# EAGLE design SiNEDevBoard (EAGLE 6.1)
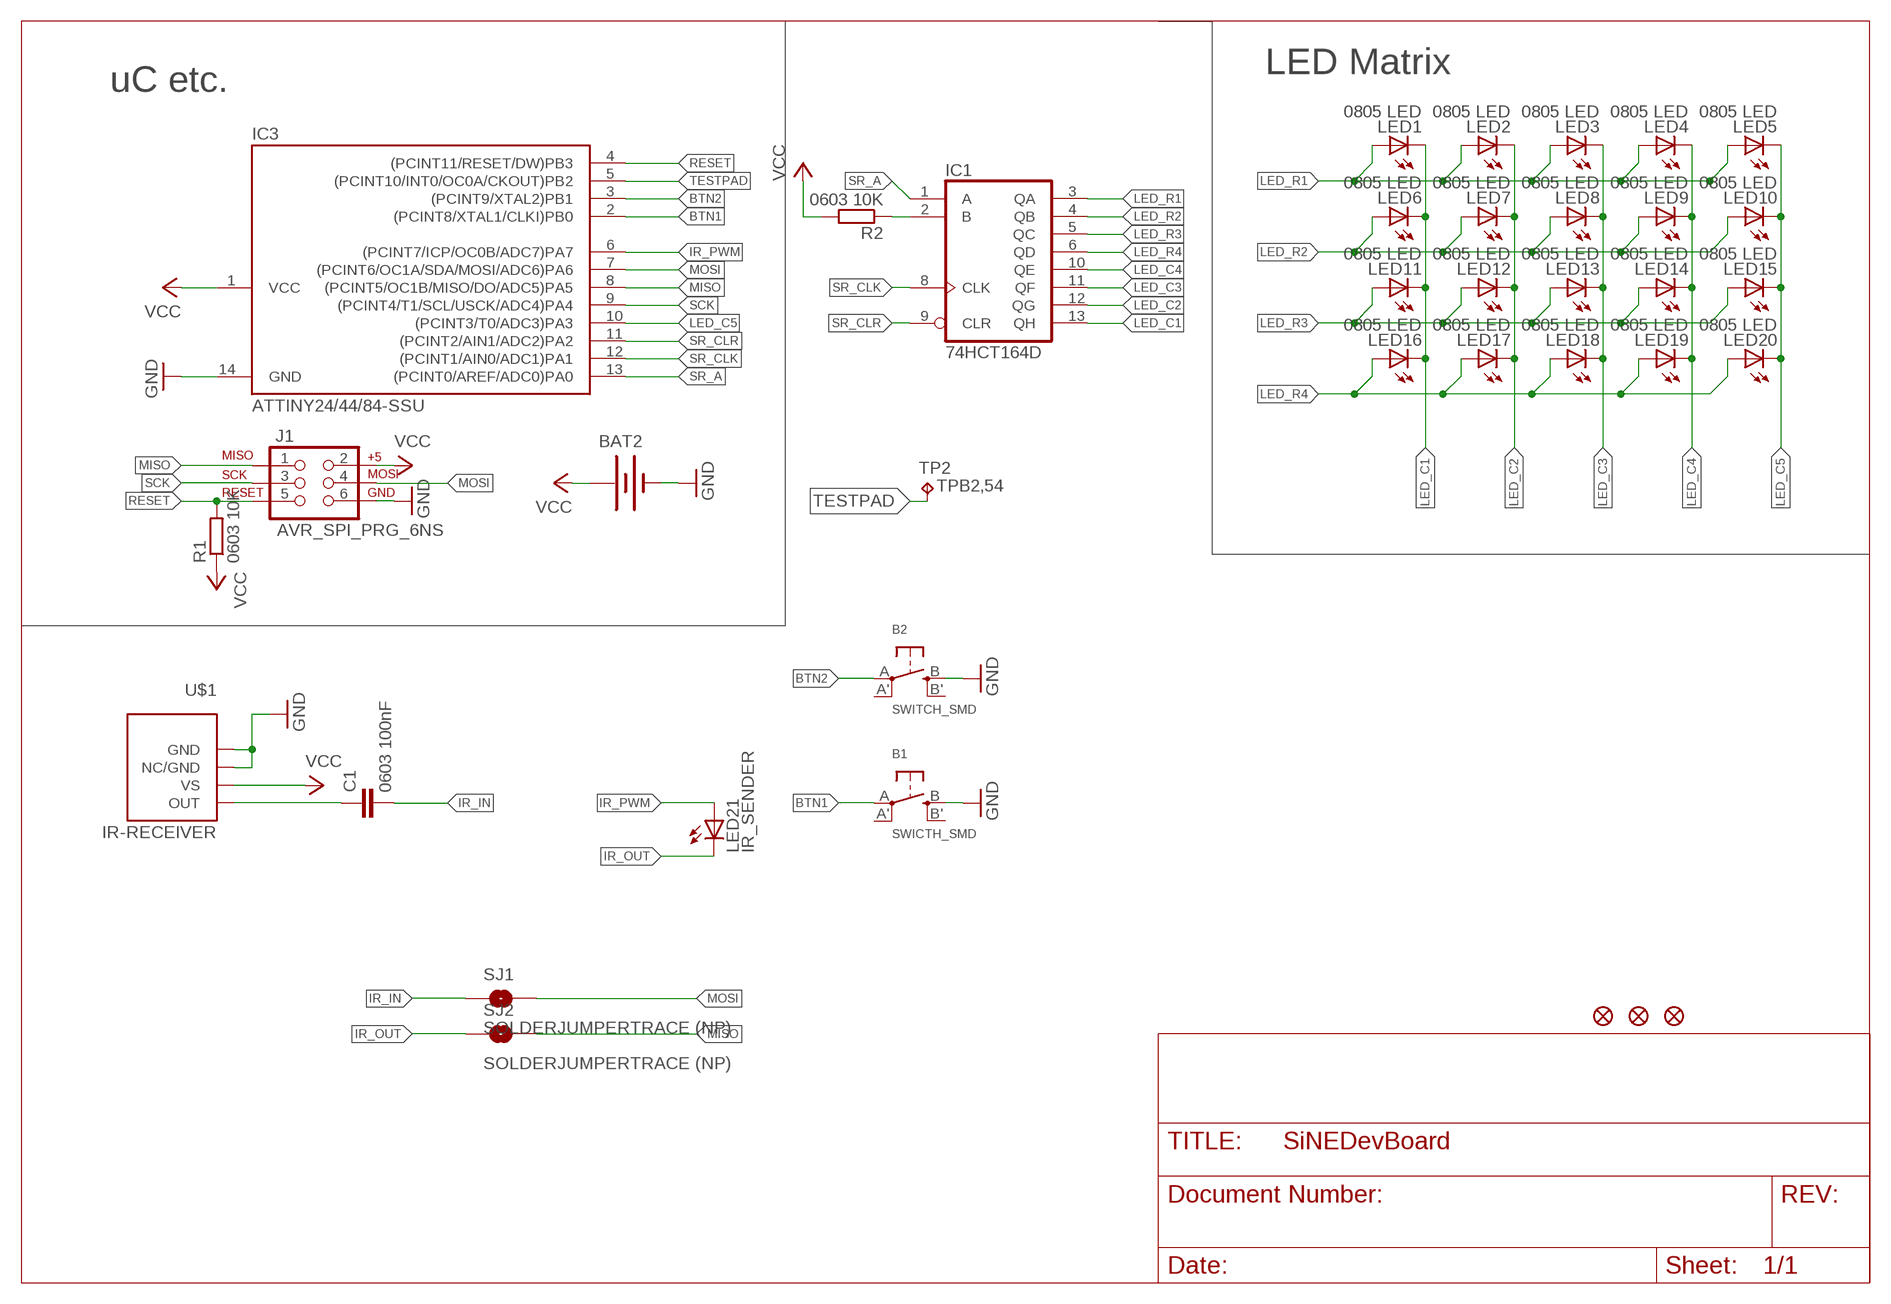
[diagram p0: schematic, sheet 1]

## Parts
B1  SWICTH_SMD  SWITCH_TACT_SMT  [EVQ-Q2]
B2  SWITCH_SMD  SWITCH_TACT_SMT  [EVQ-Q2]
BAT2  BATTERY20SMD  [BATTCON_20MM]
C1  0603 100nF  C-EUC0805  [C0805]
IC1  74HCT164D  [SO14]
IC3  ATTINY24/44/84-SSU  [SOIC14]
J1  AVR_SPI_PRG_6NS  [2X3-NS]
JP1  FIDUCIAL1X2.5-STOP  [FIDUCIAL-1X2.5-STOP]
JP2  FIDUCIAL1X2.5-STOP  [FIDUCIAL-1X2.5-STOP]
JP3  FIDUCIAL1X2.5-STOP  [FIDUCIAL-1X2.5-STOP]
LED1  0805 LED  LEDCHIPLED_0805  [CHIPLED_0805]
LED2  0805 LED  LEDCHIPLED_0805  [CHIPLED_0805]
LED3  0805 LED  LEDCHIPLED_0805  [CHIPLED_0805]
LED4  0805 LED  LEDCHIPLED_0805  [CHIPLED_0805]
LED5  0805 LED  LEDCHIPLED_0805  [CHIPLED_0805]
LED6  0805 LED  LEDCHIPLED_0805  [CHIPLED_0805]
LED7  0805 LED  LEDCHIPLED_0805  [CHIPLED_0805]
LED8  0805 LED  LEDCHIPLED_0805  [CHIPLED_0805]
LED9  0805 LED  LEDCHIPLED_0805  [CHIPLED_0805]
LED10  0805 LED  LEDCHIPLED_0805  [CHIPLED_0805]
LED11  0805 LED  LEDCHIPLED_0805  [CHIPLED_0805]
LED12  0805 LED  LEDCHIPLED_0805  [CHIPLED_0805]
LED13  0805 LED  LEDCHIPLED_0805  [CHIPLED_0805]
LED14  0805 LED  LEDCHIPLED_0805  [CHIPLED_0805]
LED15  0805 LED  LEDCHIPLED_0805  [CHIPLED_0805]
LED16  0805 LED  LEDCHIPLED_0805  [CHIPLED_0805]
LED17  0805 LED  LEDCHIPLED_0805  [CHIPLED_0805]
LED18  0805 LED  LEDCHIPLED_0805  [CHIPLED_0805]
LED19  0805 LED  LEDCHIPLED_0805  [CHIPLED_0805]
LED20  0805 LED  LEDCHIPLED_0805  [CHIPLED_0805]
LED21  IR_SENDER  LEDCHIPLED_1206  [CHIPLED_1206]
R1  0603 10K  R-EU_R0805  [R0805]
R2  0603 10K  R-EU_R0805  [R0805]
SJ1  SOLDERJUMPERTRACE (NP)  SOLDERJUMPERTRACE  [SJ_2S-TRACE]
SJ2  SOLDERJUMPERTRACE (NP)  SOLDERJUMPERTRACE  [SJ_2S-TRACE]
TP2  TPB2,54  [B2,54]
U$1  IR-RECEIVER  [TSOP35X]

## Nets
BTN1: B1.A(P) IC3.2((PCINT8/XTAL1/CLKI)PB0)
BTN2: B2.A(P) IC3.3((PCINT9/XTAL2)PB1)
GND: B1.B(S) B2.B(S) BAT2.2(-) IC3.14(GND) J1.6 U$1.1(GND) U$1.2(NC/GND)
IR_IN: C1.2 SJ1.1
IR_OUT: LED21.C SJ2.1
IR_PWM: IC3.6((PCINT7/ICP/OC0B/ADC7)PA7) LED21.A
LED_C1: IC1.13(QH) LED1.C LED6.C LED11.C LED16.C
LED_C2: IC1.12(QG) LED2.C LED7.C LED12.C LED17.C
LED_C3: IC1.11(QF) LED3.C LED8.C LED13.C LED18.C
LED_C4: IC1.10(QE) LED4.C LED9.C LED14.C LED19.C
LED_C5: IC3.10((PCINT3/T0/ADC3)PA3) LED5.C LED10.C LED15.C LED20.C
LED_R1: IC1.3(QA) LED1.A LED2.A LED3.A LED4.A LED5.A
LED_R2: IC1.4(QB) LED6.A LED7.A LED8.A LED9.A LED10.A
LED_R3: IC1.5(QC) LED11.A LED12.A LED13.A LED14.A LED15.A
LED_R4: IC1.6(QD) LED16.A LED17.A LED18.A LED19.A LED20.A
MISO: IC3.8((PCINT5/OC1B/MISO/DO/ADC5)PA5) J1.1 SJ2.2
MOSI: IC3.7((PCINT6/OC1A/SDA/MOSI/ADC6)PA6) J1.4 SJ1.2
N$1: IC1.2(B) R2.1
N$6: C1.1 U$1.4(OUT)
RESET: IC3.4((PCINT11/RESET/DW)PB3) J1.5 R1.2
SCK: IC3.9((PCINT4/T1/SCL/USCK/ADC4)PA4) J1.3
SR_A: IC1.1(A) IC3.13((PCINT0/AREF/ADC0)PA0)
SR_CLK: IC1.8(CLK) IC3.12((PCINT1/AIN0/ADC1)PA1)
SR_CLR: IC1.9(CLR) IC3.11((PCINT2/AIN1/ADC2)PA2)
TESTPAD: IC3.5((PCINT10/INT0/OC0A/CKOUT)PB2) TP2.TP
VCC: BAT2.1(+) IC3.1(VCC) J1.2 R1.1 R2.2 U$1.3(VS)
Unconnected: B1.A'(P1) B1.B'(S1) B2.A'(P1) B2.B'(S1)

## Notes on the sheet
- LED Matrix
- uC etc.

## Power pins joined to a net without a drawn wire
GND: IC1.7(GND)
VCC: IC1.14(VCC)

## Library data of the parts
B1 B2 = microbuilder:SWITCH_TACT_SMT: SMT Tact Switches 6x6mm - Digikey: P12940SCT-ND KMR2 (4.6x2.8mm) - Digikey: 401-1426-1-ND EVQ-PQHB55 - Light Touch, 160GF (4.5x4.5mm) - Digikey: P8090SCT-ND
BAT2 = SiNE Parts:BATTERY: Battery Holders Various common sizes : AA, AAA, 20mm coin cell and 12mm coin cell.
C1 = rcl:C-EU: CAPACITOR, European symbol
IC1 = SiNE Parts:74*164: 8-bit parallel out SHIFT REGISTER
IC3 = SiNE Parts:ATTINY24/44/84
J1 = AVR Header:AVR_SPI_PRG_6: AVR ISP 6 Pin This is the reduced ISP connector for AVR programming. Common on Arduino. This footprint will take up less PCB space and can be used with a 10-pin to 6-pin adapter such as SKU: BOB-08508
JP1-JP3 = CISECO eaglecad designs:FIDUCIAL: Fiducial Alignment Points Various fiducial points for machine vision alignment.
LED1-LED20 = adafruit:LED: LED
LED21 = led:LED: LED
R1 R2 = rcl:R-EU_: RESISTOR, European symbol
SJ1 SJ2 = SparkFun:SOLDERJUMPER: Solder Jumper Standard SMD solder jumper. Used to automate production. Two varients : Normally Open and Normally Closed are the same, but have different paste layers. NC will have a large amount of paste and should jumper during reflow.
TP2 = SiNE Parts:TP: Test pad
U$1 = SiNE Parts:IR-RECEIVER

## Board
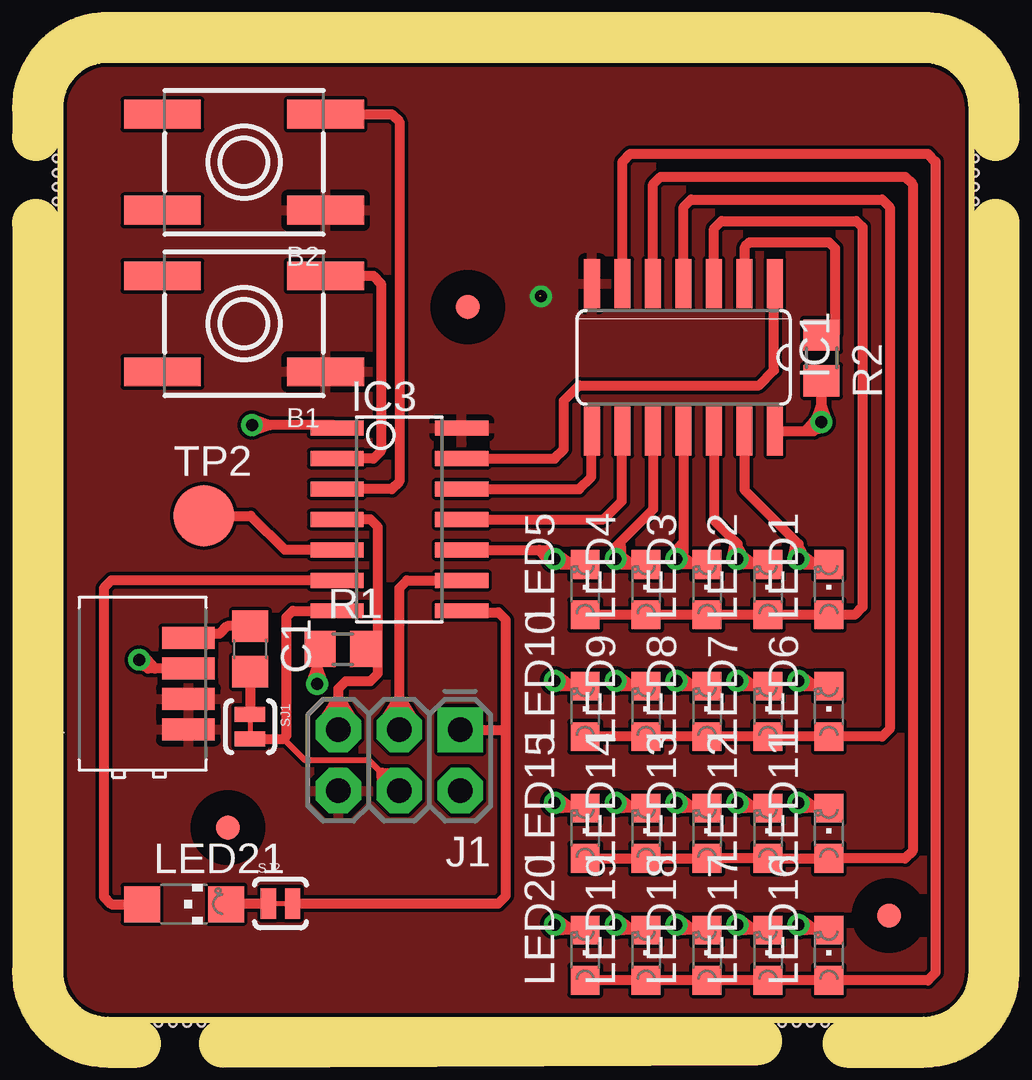
[diagram p1: board, top side]
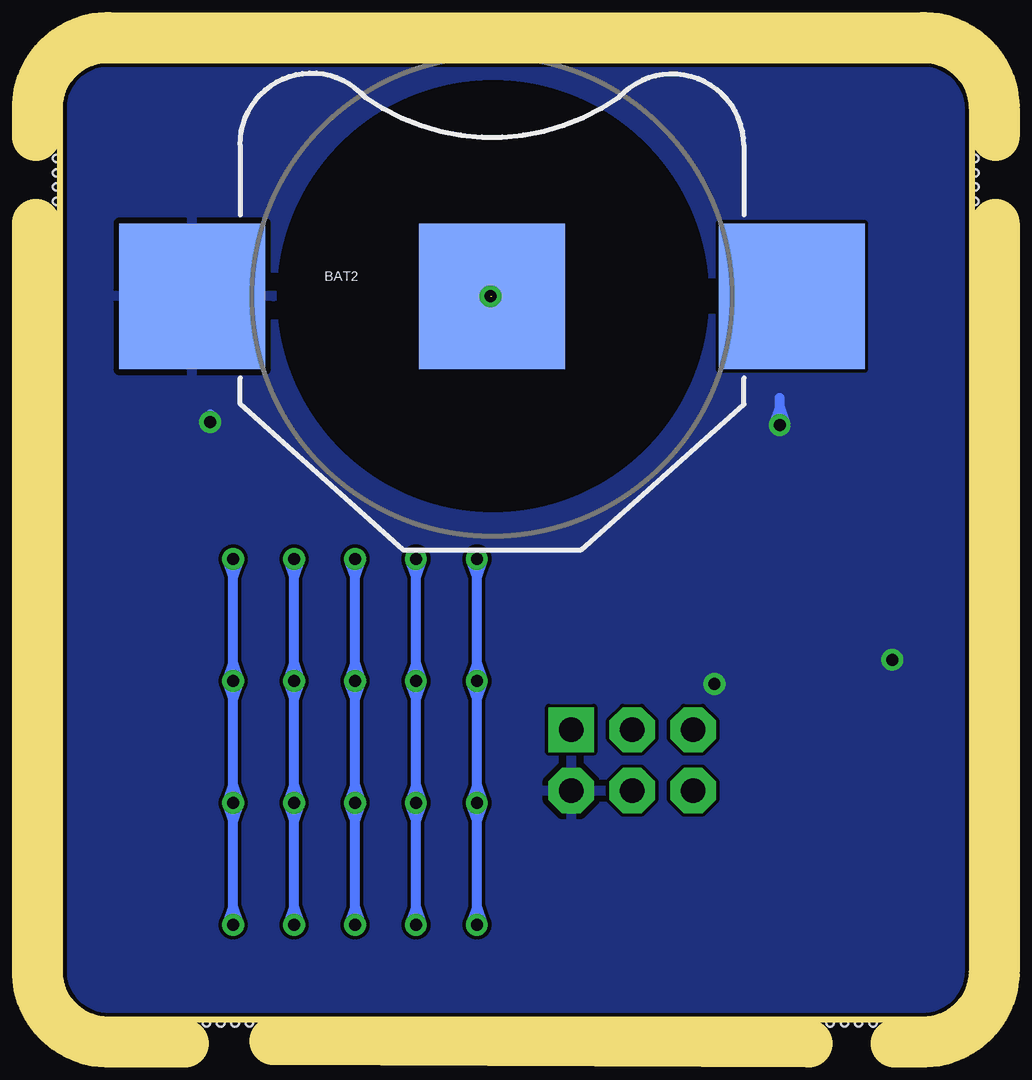
[diagram p2: board, bottom side, seen from below]

Size 38 x 40 mm. Coordinates in mm from the lower left corner, seen from the top.
Outline: 36,40 2,40 arc90 0,38 0,2 arc90 2,0 36,0 arc90 38,2 38,38 arc90 36,40
Copper layers (1*16): Top 0.035mm / dielectric 1mm / Bottom 0.035mm
Design rules: minimum track width 0.15mm, minimum drill 0.3mm, track to track 0.15mm, track to pad 0.15mm, pad to pad 0.15mm, via to via 0.15mm, smd to smd 0mil, copper to edge 0.15mm, drill to drill 0.15mm, minimum pad ring 10mil, minimum via ring 8mil, stop-mask expansion 4mil, vias tented up to drill 23mil, thermal gap 10mil
Holes 0.3 mm at 4.1,-0.15 4.7,-0.15 5.3,-0.15 5.9,-0.15 30.1,-0.15 30.7,-0.15 31.3,-0.15 31.9,-0.15 -0.15,35.9 -0.15,35.3 -0.15,34.7 -0.15,34.1 38.15,34.1 38.15,34.7 38.15,35.3 38.15,35.9
bRestrict: area 11,21.1 to 29,39.1
Milling: 12 lines

### Footprints (pad centres in the part's own frame; a part is rotated, then mirrored left to right if it is on the bottom)
EVQ-Q2 = smd 3.2 x 1.2: A -3.4,-2; A' 3.4,-2; B -3.4,2; B' 3.4,2
BATTCON_20MM = smd 6.07 x 6.07: 1 -12.5,0; 2 0,0; 3 12.5,0
C0805 = smd 1.3 x 1.5: 1 -0.95,0; 2 0.95,0
SO14 = smd 0.66 x 2.032: 1 -3.81,-3.073; 2 -2.54,-3.073; 3 -1.27,-3.073; 4 0,-3.073; 5 1.27,-3.073; 6 2.54,-3.073; 7 3.81,-3.073; 8 3.81,3.073; 9 2.54,3.073; 10 1.27,3.073; 11 0,3.073; 12 -1.27,3.073; 13 -2.54,3.073; 14 -3.81,3.073
SOIC14 = smd 0.61 x 2.21: 1 -3.81,-2.603; 2 -2.54,-2.603; 3 -1.27,-2.603; 4 0,-2.603; 5 1.27,-2.603; 6 2.54,-2.603; 7 3.81,-2.603; 8 3.81,2.603; 9 2.54,2.603; 10 1.27,2.603; 11 0,2.603; 12 -1.27,2.603; 13 -2.54,2.603; 14 -3.81,2.603
2X3-NS = drill 1.016 pad 1.88 square: 1 -2.54,-1.27 | drill 1.016 pad 1.88 octagon: 2 -2.54,1.27; 3 0,-1.27; 4 0,1.27; 5 2.54,-1.27; 6 2.54,1.27
FIDUCIAL-1X2.5-STOP = smd 1 x 1: 1 0,0
CHIPLED_0805@1 = smd 1.2 x 1.2: A 0,-1.05; C 0,1.05
CHIPLED_1206@1 = smd 1.5 x 1.5: A 0,-1.75; C 0,1.75
R0805 = smd 1.3 x 1.5: 1 -0.95,0; 2 0.95,0
SJ_2S-TRACE = smd 0.635 x 1.27: 1 -0.508,0; 2 0.508,0
B2,54 = smd 2.54 x 2.54: TP 0,0
TSOP35X = smd 0.9 x 2.2: 1 -1.905,-2.055; 2 -0.635,-2.055; 3 0.635,-2.055; 4 1.905,-2.055

### Placement (x,y rotation side)
B1  7.67,29 180 top
B2  7.67,35.73 180 top
BAT2  19.99,30.15 0 bottom
C1  7.93,15.45 270 top
IC1  25.99,27.6 180 top
IC3  14.15,20.84 270 top
J1  14.15,10.81 180 top
JP1  7,8 0 top
JP2  17,29.7 0 top
JP3  34.56,4.33 0 top
LED1  0805 LED  [CHIPLED_0805@1]  32.05,17.92 0 top
LED2  0805 LED  [CHIPLED_0805@1]  29.51,17.92 0 top
LED3  0805 LED  [CHIPLED_0805@1]  26.97,17.92 0 top
LED4  0805 LED  [CHIPLED_0805@1]  24.43,17.92 0 top
LED5  0805 LED  [CHIPLED_0805@1]  21.89,17.92 0 top
LED6  0805 LED  [CHIPLED_0805@1]  32.05,12.84 0 top
LED7  0805 LED  [CHIPLED_0805@1]  29.51,12.84 0 top
LED8  0805 LED  [CHIPLED_0805@1]  26.97,12.84 0 top
LED9  0805 LED  [CHIPLED_0805@1]  24.43,12.84 0 top
LED10  0805 LED  [CHIPLED_0805@1]  21.89,12.84 0 top
LED11  0805 LED  [CHIPLED_0805@1]  32.05,7.76 0 top
LED12  0805 LED  [CHIPLED_0805@1]  29.51,7.76 0 top
LED13  0805 LED  [CHIPLED_0805@1]  26.97,7.76 0 top
LED14  0805 LED  [CHIPLED_0805@1]  24.43,7.76 0 top
LED15  0805 LED  [CHIPLED_0805@1]  21.89,7.76 0 top
LED16  0805 LED  [CHIPLED_0805@1]  32.05,2.68 0 top
LED17  0805 LED  [CHIPLED_0805@1]  29.51,2.68 0 top
LED18  0805 LED  [CHIPLED_0805@1]  26.97,2.68 0 top
LED19  0805 LED  [CHIPLED_0805@1]  24.43,2.68 0 top
LED20  0805 LED  [CHIPLED_0805@1]  21.89,2.68 0 top
LED21  IR_SENDER  [CHIPLED_1206@1]  5.17,4.81 270 top
R1  11.8,15.45 0 top
R2  31.74,27.58 270 top
SJ1  7.92,12.21 270 top
SJ2  9.19,4.84 0 top
TP2  6,21 0 top
U$1  3.3,14 90 top

### Tracks (layer width: path | path; a pad name or v marks a point on that pad's centre or on a via)
BTN1
  Top 0.406: B1.A 13.07,31 13.38,30.69 13.38,23.7 13.07,23.38 IC3.2
BTN2
  Top 0.406: B2.A 13.83,37.73 14.15,37.42 14.15,22.43 13.83,22.11 IC3.3
GND  (via drill 0.5)  (1 unrouted)
  Bottom 0.406: 19.86,32.21 19.98,30.89 | 19.98,30.89 v20.05,30.15 | 19.98,30.89 19.81,30.21 v20.05,30.15 | 19.98,30.89 20.28,30.25 v20.05,30.15
  pour Top: 0,2 0,38 arc-90 2,40 36,40 arc-90 38,38 38,2 arc-90 36,0 2,0 arc-90
IR_IN
  Top 0.406: C1.2 SJ1.1
IR_OUT
  Top 0.406: LED21.C 6.95,4.84 SJ2.1
IR_PWM
  Top 0.406: IC3.6 2.14,18.3 1.83,17.99 1.83,5.13 2.14,4.81 LED21.A
LED_C1  (via drill 0.5)
  Top 0.406: LED16.C 31.5,3.73 | 31.5,3.73 31,3.73 v30.78,3.95 | v30.78,19.19 31,18.97 31.5,18.97 | 31.5,18.97 LED1.C | LED11.C 31.5,8.81 | 31.5,8.81 31,8.81 v30.78,9.03 | LED6.C 31.5,13.89 | 31.5,13.89 31,13.89 v30.78,14.11 | IC1.13 28.53,22.08 30.68,19.93 | 30.68,19.93 30.78,19.83 v30.78,19.19 | 31.5,3.73 30.93,4.15 v30.78,3.95 | 31.5,3.73 30.79,3.7 v30.78,3.95 | 31.5,18.97 30.93,19.39 v30.78,19.19 | 31.5,18.97 30.79,18.94 v30.78,19.19 | 30.68,19.93 30.54,19.24 v30.78,19.19 | 30.68,19.93 31,19.31 v30.78,19.19 | 31.5,8.81 30.93,9.23 v30.78,9.03 | 31.5,8.81 30.79,8.78 v30.78,9.03 | 31.5,13.89 30.93,14.31 v30.78,14.11 | 31.5,13.89 30.79,13.86 v30.78,14.11
  Bottom 0.406: v30.78,3.95 30.78,4.7 | 30.78,4.7 30.78,8.28 | 30.78,8.28 v30.78,9.03 | v30.78,9.03 30.78,9.78 | 30.78,9.78 30.78,13.36 | 30.78,13.36 v30.78,14.11 | v30.78,14.11 30.78,14.86 | 30.78,14.86 30.78,18.44 | 30.78,18.44 v30.78,19.19 | 30.78,4.7 30.55,4.04 v30.78,3.95 | 30.78,4.7 31.02,4.04 v30.78,3.95 | 30.78,18.44 31.02,19.11 v30.78,19.19 | 30.78,18.44 30.55,19.11 v30.78,19.19 | 30.78,8.28 31.02,8.95 v30.78,9.03 | 30.78,8.28 30.55,8.95 v30.78,9.03 | 30.78,9.78 30.55,9.12 v30.78,9.03 | 30.78,9.78 31.02,9.12 v30.78,9.03 | 30.78,13.36 31.02,14.03 v30.78,14.11 | 30.78,13.36 30.55,14.03 v30.78,14.11 | 30.78,14.86 30.55,14.2 v30.78,14.11 | 30.78,14.86 31.02,14.2 v30.78,14.11
LED_C2  (via drill 0.5)
  Top 0.406: LED17.C 28.96,3.73 | 28.96,3.73 28.46,3.73 v28.24,3.95 | LED12.C 28.96,8.81 | 28.96,8.81 28.46,8.81 v28.24,9.03 | LED7.C 28.96,13.89 | 28.96,13.89 28.46,13.89 v28.24,14.11 | LED2.C 28.96,18.97 | 28.96,18.97 28.46,18.97 v28.24,19.19 | IC1.12 27.26,20.81 28.14,19.93 | 28.14,19.93 28.24,19.83 v28.24,19.19 | 28.96,3.73 28.39,4.15 v28.24,3.95 | 28.96,3.73 28.25,3.7 v28.24,3.95 | 28.96,8.81 28.39,9.23 v28.24,9.03 | 28.96,8.81 28.25,8.78 v28.24,9.03 | 28.96,13.89 28.39,14.31 v28.24,14.11 | 28.96,13.89 28.25,13.86 v28.24,14.11 | 28.96,18.97 28.39,19.39 v28.24,19.19 | 28.96,18.97 28.25,18.94 v28.24,19.19 | 28.14,19.93 28,19.24 v28.24,19.19 | 28.14,19.93 28.46,19.31 v28.24,19.19
  Bottom 0.406: v28.24,3.95 28.24,4.7 | 28.24,4.7 28.24,8.28 | 28.24,8.28 v28.24,9.03 | v28.24,9.03 28.24,9.78 | 28.24,9.78 28.24,13.36 | 28.24,13.36 v28.24,14.11 | v28.24,14.11 28.24,14.86 | 28.24,14.86 28.24,18.44 | 28.24,18.44 v28.24,19.19 | 28.24,4.7 28.01,4.04 v28.24,3.95 | 28.24,4.7 28.48,4.04 v28.24,3.95 | 28.24,8.28 28.48,8.95 v28.24,9.03 | 28.24,8.28 28.01,8.95 v28.24,9.03 | 28.24,9.78 28.01,9.12 v28.24,9.03 | 28.24,9.78 28.48,9.12 v28.24,9.03 | 28.24,13.36 28.48,14.03 v28.24,14.11 | 28.24,13.36 28.01,14.03 v28.24,14.11 | 28.24,14.86 28.01,14.2 v28.24,14.11 | 28.24,14.86 28.48,14.2 v28.24,14.11 | 28.24,18.44 28.48,19.11 v28.24,19.19 | 28.24,18.44 28.01,19.11 v28.24,19.19
LED_C3  (via drill 0.5)
  Top 0.406: LED18.C 26.42,3.73 | 26.42,3.73 25.92,3.73 v25.7,3.95 | LED13.C 26.42,8.81 | 26.42,8.81 25.92,8.81 v25.7,9.03 | LED8.C 26.42,13.89 | 26.42,13.89 25.92,13.89 v25.7,14.11 | LED3.C 26.42,18.97 | 26.42,18.97 25.92,18.97 v25.7,19.19 | IC1.11 25.99,19.89 | 25.99,19.89 25.99,19.48 v25.7,19.19 | 26.42,3.73 25.85,4.15 v25.7,3.95 | 26.42,3.73 25.71,3.7 v25.7,3.95 | 26.42,18.97 25.85,19.39 v25.7,19.19 | 26.42,18.97 25.71,18.94 v25.7,19.19 | 25.99,19.89 25.52,19.36 v25.7,19.19 | 25.99,19.89 25.95,19.18 v25.7,19.19 | 26.42,13.89 25.85,14.31 v25.7,14.11 | 26.42,13.89 25.71,13.86 v25.7,14.11 | 26.42,8.81 25.85,9.23 v25.7,9.03 | 26.42,8.81 25.71,8.78 v25.7,9.03
  Bottom 0.406: v25.7,3.95 25.7,4.7 | 25.7,4.7 25.7,8.28 | 25.7,8.28 v25.7,9.03 | v25.7,9.03 25.7,9.78 | 25.7,9.78 25.7,13.36 | 25.7,13.36 v25.7,14.11 | v25.7,14.11 25.7,14.86 | 25.7,14.86 25.7,18.44 | 25.7,18.44 v25.7,19.19 | 25.7,4.7 25.47,4.04 v25.7,3.95 | 25.7,4.7 25.94,4.04 v25.7,3.95 | 25.7,18.44 25.94,19.11 v25.7,19.19 | 25.7,18.44 25.47,19.11 v25.7,19.19 | 25.7,13.36 25.94,14.03 v25.7,14.11 | 25.7,13.36 25.47,14.03 v25.7,14.11 | 25.7,14.86 25.47,14.2 v25.7,14.11 | 25.7,14.86 25.94,14.2 v25.7,14.11 | 25.7,8.28 25.94,8.95 v25.7,9.03 | 25.7,8.28 25.47,8.95 v25.7,9.03 | 25.7,9.78 25.47,9.12 v25.7,9.03 | 25.7,9.78 25.94,9.12 v25.7,9.03
LED_C4  (via drill 0.5)
  Top 0.406: LED19.C 23.88,3.73 | 23.88,3.73 23.38,3.73 v23.16,3.95 | v23.16,19.19 23.38,18.97 23.88,18.97 | 23.88,18.97 LED4.C | LED14.C 23.88,8.81 | 23.88,8.81 23.38,8.81 v23.16,9.03 | LED9.C 23.88,13.89 | 23.88,13.89 23.38,13.89 v23.16,14.11 | IC1.10 24.72,21.26 23.38,19.91 | 23.38,19.91 23.16,19.7 v23.16,19.19 | 23.88,3.73 23.31,4.15 v23.16,3.95 | 23.88,3.73 23.17,3.7 v23.16,3.95 | 23.88,18.97 23.31,19.39 v23.16,19.19 | 23.88,18.97 23.17,18.94 v23.16,19.19 | 23.38,19.91 22.96,19.34 v23.16,19.19 | 23.38,19.91 23.41,19.21 v23.16,19.19 | 23.88,8.81 23.31,9.23 v23.16,9.03 | 23.88,8.81 23.17,8.78 v23.16,9.03 | 23.88,13.89 23.31,14.31 v23.16,14.11 | 23.88,13.89 23.17,13.86 v23.16,14.11
  Bottom 0.406: v23.16,3.95 23.16,4.7 | 23.16,4.7 23.16,8.28 | 23.16,8.28 v23.16,9.03 | v23.16,9.03 23.16,9.78 | 23.16,9.78 23.16,13.36 | 23.16,13.36 v23.16,14.11 | v23.16,14.11 23.16,14.86 | 23.16,14.86 23.16,18.44 | 23.16,18.44 v23.16,19.19 | 23.16,4.7 22.93,4.04 v23.16,3.95 | 23.16,4.7 23.4,4.04 v23.16,3.95 | 23.16,18.44 23.4,19.11 v23.16,19.19 | 23.16,18.44 22.93,19.11 v23.16,19.19 | 23.16,8.28 23.4,8.95 v23.16,9.03 | 23.16,8.28 22.93,8.95 v23.16,9.03 | 23.16,9.78 22.93,9.12 v23.16,9.03 | 23.16,9.78 23.4,9.12 v23.16,9.03 | 23.16,13.36 23.4,14.03 v23.16,14.11 | 23.16,13.36 22.93,14.03 v23.16,14.11 | 23.16,14.86 22.93,14.2 v23.16,14.11 | 23.16,14.86 23.4,14.2 v23.16,14.11
LED_C5  (via drill 0.5)
  Top 0.406: LED20.C 21.34,3.73 | 21.34,3.73 20.84,3.73 v20.62,3.95 | v20.62,19.19 20.84,18.97 21.34,18.97 | 21.34,18.97 LED5.C | LED15.C 21.34,8.81 | 21.34,8.81 20.84,8.81 v20.62,9.03 | LED10.C 21.34,13.89 | 21.34,13.89 20.84,13.89 v20.62,14.11 | IC3.10 19.98,19.57 | 19.98,19.57 20.3,19.57 20.62,19.26 v20.62,19.19 | 21.34,3.73 20.77,4.15 v20.62,3.95 | 21.34,3.73 20.63,3.7 v20.62,3.95 | 21.34,18.97 20.77,19.39 v20.62,19.19 | 21.34,18.97 20.63,18.94 v20.62,19.19 | 19.98,19.57 20.43,19.03 v20.62,19.19 | 19.98,19.57 20.67,19.44 v20.62,19.19 | 21.34,8.81 20.77,9.23 v20.62,9.03 | 21.34,8.81 20.63,8.78 v20.62,9.03 | 21.34,13.89 20.77,14.31 v20.62,14.11 | 21.34,13.89 20.63,13.86 v20.62,14.11
  Bottom 0.406: v20.62,3.95 20.62,4.7 | 20.62,4.7 20.62,8.28 | 20.62,8.28 v20.62,9.03 | v20.62,9.03 20.62,9.78 | 20.62,9.78 20.62,13.36 | 20.62,13.36 v20.62,14.11 | v20.62,14.11 20.62,14.86 | 20.62,14.86 20.62,18.44 | 20.62,18.44 v20.62,19.19 | 20.62,4.7 20.39,4.04 v20.62,3.95 | 20.62,4.7 20.86,4.04 v20.62,3.95 | 20.62,18.44 20.86,19.11 v20.62,19.19 | 20.62,18.44 20.39,19.11 v20.62,19.19 | 20.62,8.28 20.86,8.95 v20.62,9.03 | 20.62,8.28 20.39,8.95 v20.62,9.03 | 20.62,9.78 20.39,9.12 v20.62,9.03 | 20.62,9.78 20.86,9.12 v20.62,9.03 | 20.62,13.36 20.86,14.03 v20.62,14.11 | 20.62,13.36 20.39,14.03 v20.62,14.11 | 20.62,14.86 20.39,14.2 v20.62,14.11 | 20.62,14.86 20.86,14.2 v20.62,14.11
LED_R1
  Top 0.406: LED5.A LED4.A LED3.A LED2.A LED1.A 33.13,16.87 33.45,17.19 33.45,33.04 33.2,33.29 27.58,33.29 27.26,32.97 IC1.3
LED_R2
  Top 0.406: LED10.A LED9.A LED8.A LED7.A LED6.A 34.28,11.79 34.59,12.11 34.59,33.86 34.28,34.18 26.31,34.18 25.99,33.86 IC1.4
LED_R3
  Top 0.406: LED15.A LED14.A LED13.A LED12.A LED11.A 35.23,6.71 35.55,7.03 35.55,34.81 35.23,35.13 25.04,35.13 24.72,34.81 IC1.5
LED_R4
  Top 0.406: LED20.A LED19.A LED18.A LED17.A LED16.A 36.18,1.63 36.5,1.95 36.5,35.77 36.18,36.08 23.77,36.08 23.45,35.77 IC1.6
MISO
  Top 0.406: IC3.8 16.69,16.97 18.27,16.97 18.59,16.65 18.59,12.08 | SJ2.2 18.27,4.84 18.59,5.16 18.59,12.08 | J1.1 18.59,12.08
MOSI
  Top 0.254: J1.4 13.43,10.26 12.88,10.81 10.21,10.81 9.45,11.57 9.45,11.83
  Top 0.406: IC3.7 9.7,17.03 9.45,16.78 9.45,11.83 9.32,11.7 SJ1.2
  Top 0.508: 13.43,10.26 13.46,9.51 J1.4 14.18,10.23 13.43,10.26
N$1
  Top 0.406: IC1.2 28.56,30.65 28.56,32.21 28.75,32.4 32.05,32.4 32.31,32.15 32.31,28.6 R2.1
N$6
  Top 0.406: C1.1 6.97,16.4 6.65,16.08 5.05,16.08 U$1.4
RESET
  Top 0.406: J1.5 11.61,13.1 11.61,13.8 11.92,14.11 12.94,14.11 13.26,14.43 13.26,15.51 | 13.26,15.51 13.26,20.53 12.94,20.84 IC3.4 | R1.2 13.19,15.45 13.26,15.51
  Top 0.813: 11.61,13.1 11.15,12.36 J1.5 12.06,12.36 11.61,13.1
SCK
  Top 0.406: J1.3 14.15,13.1 14.15,17.99 14.46,18.3 IC3.9
  Top 0.813: 14.15,13.1 13.69,12.36 J1.3 14.6,12.36 14.15,13.1
SR_A
  Top 0.406: IC3.13 20.62,23.38 21,23.77 21,25.8 21.64,26.43 29.13,26.43 29.77,27.07 29.77,30.64 IC1.1
SR_CLK
  Top 0.406: IC3.12 21.64,22.11 22.15,22.62 22.15,24.49 IC1.8
SR_CLR
  Top 0.406: IC3.11 22.66,20.84 23.42,21.61 23.42,24.49 IC1.9
TESTPAD
  Top 0.406: IC3.5 9.38,19.57 7.95,21 TP2.TP
VCC  (via drill 0.5)
  Top 0.406: IC1.14 31.09,24.53 | 31.09,24.53 31.42,24.53 31.74,24.85 31.74,25.66 | 31.74,25.66 R2.2 31.73,25.66 | 31.73,25.66 v31.73,24.91 | R1.1 10.72,15.32 10.72,14.74 | 10.72,14.74 v10.72,13.99 | IC3.1 11.48,24.72 11.43,24.77 11.43,24.78 8.75,24.78 | 8.75,24.78 v8,24.78 | U$1.3 3.96,14.63 | 3.96,14.63 3.67,14.63 v3.3,15 | 31.09,24.53 31.78,24.66 v31.73,24.91 | 31.09,24.53 31.55,25.07 v31.73,24.91 | 31.74,25.66 31.5,24.99 v31.73,24.91 | 31.74,25.66 31.97,24.99 v31.73,24.91 | 31.73,25.66 31.5,24.99 v31.73,24.91 | 31.73,25.66 31.97,24.99 v31.73,24.91 | 10.72,14.74 10.48,14.07 v10.72,13.99 | 10.72,14.74 10.95,14.07 v10.72,13.99 | 8.75,24.78 8.08,25.02 v8,24.78 | 8.75,24.78 8.08,24.55 v8,24.78 | 3.96,14.63 3.49,15.16 v3.3,15 | 3.96,14.63 3.26,14.75 v3.3,15
  Bottom 0.406: v31.73,24.91 31.73,25.23 | v10.72,13.99 10.72,14.24 | v8,24.78 8,25.53 | 8,25.53 8,25.92 | 8,25.53 7.76,24.86 v8,24.78 | 8,25.53 8.24,24.86 v8,24.78
  pour Bottom: 0,2 0,38 arc-90 2,40 36,40 arc-90 38,38 38,2 arc-90 36,0 2,0 arc-90

### Text on the board
Document: SiNE DevBoard | EMWave 2013 | v0.5